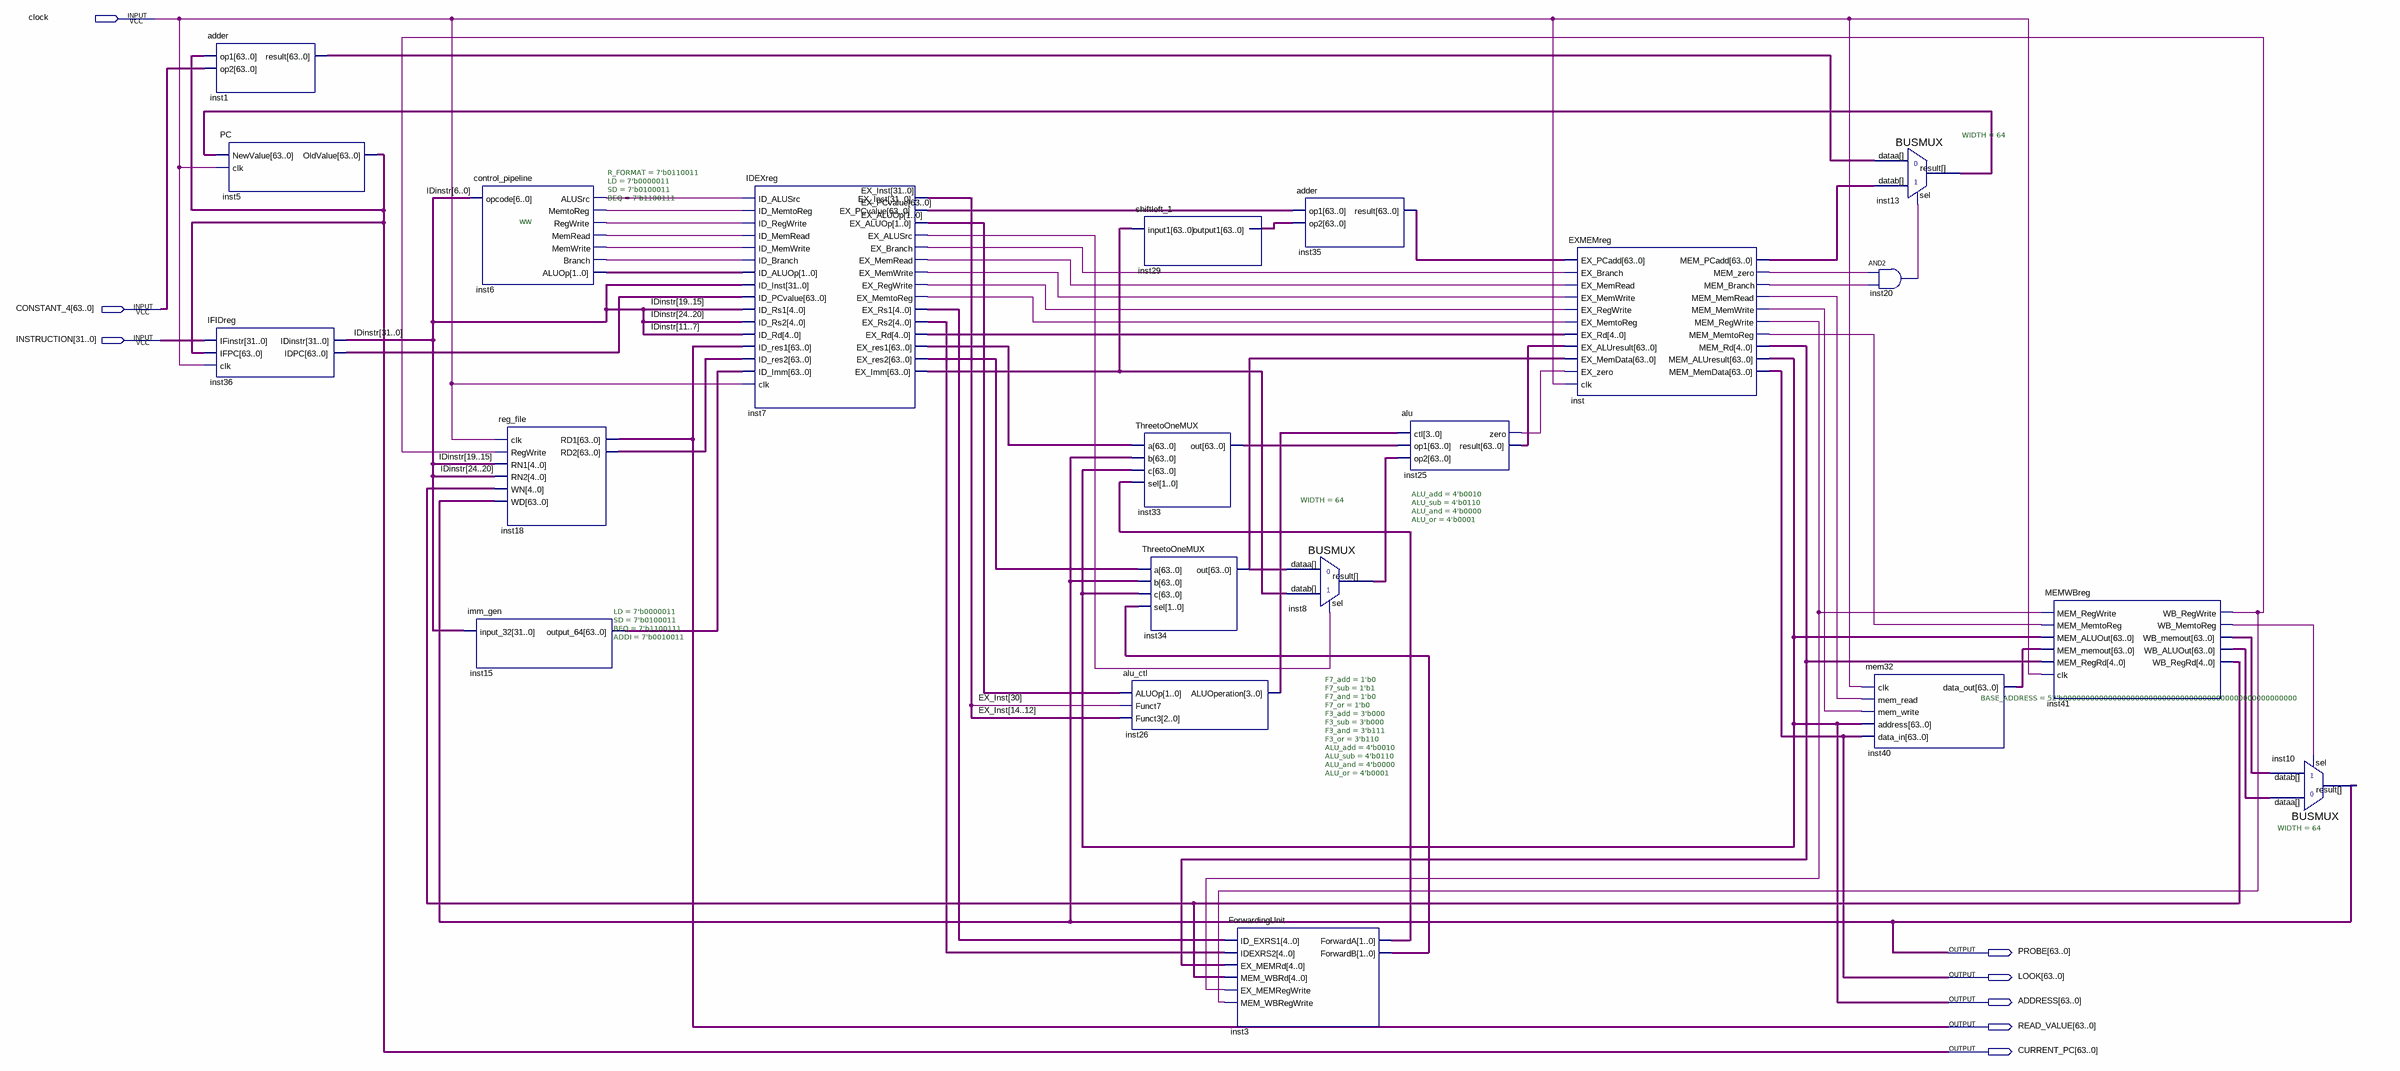
[diagram p0: schematic sheet]
// Quartus schematic project3_KSY.bdf as structural Verilog: 21 symbols, 8 pins
module project3_KSY (
  input  clock,
  input  [63:0] CONSTANT_4,
  input  [31:0] INSTRUCTION,
  output [63:0] PROBE,
  output [63:0] LOOK,
  output [63:0] ADDRESS,
  output [63:0] READ_VALUE,
  output [63:0] CURRENT_PC
);

  wire inst6_alusrc, inst6_branch, inst6_memread, inst6_memtoreg, inst6_memwrite, inst6_regwrite,
       inst7_ex_alusrc, inst7_ex_branch, inst7_ex_memread, inst7_ex_memtoreg, inst7_ex_memwrite,
       inst7_ex_regwrite, inst20_out, inst25_zero, inst41_wb_memtoreg, inst41_wb_regwrite, inst_mem_branch,
       inst_mem_memread, inst_mem_memtoreg, inst_mem_memwrite, inst_mem_regwrite, inst_mem_zero;
  wire [1:0] EX_ALUOp, inst3_forwarda, inst3_forwardb, inst6_aluop;
  wire [3:0] inst26_aluoperation;
  wire [4:0] inst7_ex_rd, inst7_ex_rs1, inst7_ex_rs2, inst41_wb_regrd, inst_mem_rd;
  wire [31:0] EX_Inst, IDinstr;
  wire [63:0] EX_PCvalue, inst1_result, inst7_ex_imm, inst7_ex_res1, inst7_ex_res2, inst8_result,
       inst13_result, inst15_output_64, inst18_rd2, inst25_result, inst29_output1, inst33_out, inst34_out,
       inst35_result, inst36_idpc, inst40_data_out, inst41_wb_aluout, inst41_wb_memout, inst_mem_pcadd;

  adder inst1 (.op1(CURRENT_PC), .op2(CONSTANT_4), .result(inst1_result));
  PC inst5 (.NewValue(inst13_result), .clk(clock), .OldValue(CURRENT_PC));
  IFIDreg inst36 (.IFinstr(INSTRUCTION), .IFPC(CURRENT_PC), .clk(clock), .IDinstr(IDinstr), .IDPC(inst36_idpc));
  control_pipeline #(.R_FORMAT(7'b0110011), .LD(7'b0000011), .SD(7'b0100011), .BEQ(7'b1100111)) inst6 (
    .opcode(IDinstr[6:0]), .ALUSrc(inst6_alusrc), .MemtoReg(inst6_memtoreg), .RegWrite(inst6_regwrite),
    .MemRead(inst6_memread), .MemWrite(inst6_memwrite), .Branch(inst6_branch), .ALUOp(inst6_aluop));
  imm_gen #(.LD(7'b0000011), .SD(7'b0100011), .BEQ(7'b1100111), .ADDI(7'b0010011)) inst15 (
    .input_32(IDinstr), .output_64(inst15_output_64));
  reg_file inst18 (
    .clk(clock), .RegWrite(inst41_wb_regwrite), .RN1(IDinstr[19:15]), .RN2(IDinstr[24:20]),
    .WN(inst41_wb_regrd), .WD(PROBE), .RD1(READ_VALUE), .RD2(inst18_rd2));
  IDEXreg inst7 (
    .ID_ALUSrc(inst6_alusrc), .ID_MemtoReg(inst6_memtoreg), .ID_RegWrite(inst6_regwrite),
    .ID_MemRead(inst6_memread), .ID_MemWrite(inst6_memwrite), .ID_Branch(inst6_branch),
    .ID_ALUOp(inst6_aluop), .ID_Inst(IDinstr), .ID_PCvalue(inst36_idpc), .ID_Rs1(IDinstr[19:15]),
    .ID_Rs2(IDinstr[24:20]), .ID_Rd(IDinstr[11:7]), .ID_res1(READ_VALUE), .ID_res2(inst18_rd2),
    .ID_Imm(inst15_output_64), .clk(clock), .EX_Inst(EX_Inst), .EX_PCvalue(EX_PCvalue), .EX_ALUOp(EX_ALUOp),
    .EX_ALUSrc(inst7_ex_alusrc), .EX_Branch(inst7_ex_branch), .EX_MemRead(inst7_ex_memread),
    .EX_MemWrite(inst7_ex_memwrite), .EX_RegWrite(inst7_ex_regwrite), .EX_MemtoReg(inst7_ex_memtoreg),
    .EX_Rs1(inst7_ex_rs1), .EX_Rs2(inst7_ex_rs2), .EX_Rd(inst7_ex_rd), .EX_res1(inst7_ex_res1),
    .EX_res2(inst7_ex_res2), .EX_Imm(inst7_ex_imm));
  shiftleft_1 inst29 (.input1(inst7_ex_imm), .output1(inst29_output1));
  ThreetoOneMUX inst33 (.a(inst7_ex_res1), .b(PROBE), .c(ADDRESS), .sel(inst3_forwarda), .out(inst33_out));
  alu_ctl #(.F7_add(1'b0), .F7_sub(1'b1), .F7_and(1'b0), .F7_or(1'b0), .F3_add(3'b000), .F3_sub(3'b000), .F3_and(3'b111), .F3_or(3'b110), .ALU_add(4'b0010), .ALU_sub(4'b0110), .ALU_and(4'b0000), .ALU_or(4'b0001)) inst26 (
    .ALUOp(EX_ALUOp), .Funct7(EX_Inst[30]), .Funct3(EX_Inst[14:12]), .ALUOperation(inst26_aluoperation));
  ThreetoOneMUX inst34 (.a(inst7_ex_res2), .b(PROBE), .c(ADDRESS), .sel(inst3_forwardb), .out(inst34_out));
  ForwardingUnit inst3 (
    .ID_EXRS1(inst7_ex_rs1), .IDEXRS2(inst7_ex_rs2), .EX_MEMRd(inst_mem_rd), .MEM_WBRd(inst41_wb_regrd),
    .EX_MEMRegWrite(inst_mem_regwrite), .MEM_WBRegWrite(inst41_wb_regwrite), .ForwardA(inst3_forwarda),
    .ForwardB(inst3_forwardb));
  adder inst35 (.op1(EX_PCvalue), .op2(inst29_output1), .result(inst35_result));
  BUSMUX #(.WIDTH(64)) inst8 (.datab(inst7_ex_imm), .sel(inst7_ex_alusrc), .dataa(inst34_out), .result(inst8_result));
  alu #(.ALU_add(4'b0010), .ALU_sub(4'b0110), .ALU_and(4'b0000), .ALU_or(4'b0001)) inst25 (
    .ctl(inst26_aluoperation), .op1(inst33_out), .op2(inst8_result), .zero(inst25_zero),
    .result(inst25_result));
  EXMEMreg inst (
    .EX_PCadd(inst35_result), .EX_Branch(inst7_ex_branch), .EX_MemRead(inst7_ex_memread),
    .EX_MemWrite(inst7_ex_memwrite), .EX_RegWrite(inst7_ex_regwrite), .EX_MemtoReg(inst7_ex_memtoreg),
    .EX_Rd(inst7_ex_rd), .EX_ALUresult(inst25_result), .EX_MemData(inst34_out), .EX_zero(inst25_zero),
    .clk(clock), .MEM_PCadd(inst_mem_pcadd), .MEM_zero(inst_mem_zero), .MEM_Branch(inst_mem_branch),
    .MEM_MemRead(inst_mem_memread), .MEM_MemWrite(inst_mem_memwrite), .MEM_RegWrite(inst_mem_regwrite),
    .MEM_MemtoReg(inst_mem_memtoreg), .MEM_Rd(inst_mem_rd), .MEM_ALUresult(ADDRESS), .MEM_MemData(LOOK));
  BUSMUX #(.WIDTH(64)) inst13 (.datab(inst_mem_pcadd), .sel(inst20_out), .dataa(inst1_result), .result(inst13_result));
  and inst20 (inst20_out, inst_mem_zero, inst_mem_branch);
  mem32 #(.BASE_ADDRESS(52'b0000000000000000000000000000000000000000000000000000)) inst40 (
    .clk(clock), .mem_read(inst_mem_memread), .mem_write(inst_mem_memwrite), .address(ADDRESS),
    .data_in(LOOK), .data_out(inst40_data_out));
  MEMWBreg inst41 (
    .MEM_RegWrite(inst_mem_regwrite), .MEM_MemtoReg(inst_mem_memtoreg), .MEM_ALUOut(ADDRESS),
    .MEM_memout(inst40_data_out), .MEM_RegRd(inst_mem_rd), .clk(clock), .WB_RegWrite(inst41_wb_regwrite),
    .WB_MemtoReg(inst41_wb_memtoreg), .WB_memout(inst41_wb_memout), .WB_ALUOut(inst41_wb_aluout),
    .WB_RegRd(inst41_wb_regrd));
  BUSMUX #(.WIDTH(64)) inst10 (
    .datab(inst41_wb_memout), .sel(inst41_wb_memtoreg), .dataa(inst41_wb_aluout), .result(PROBE));

  // Notes on the sheet:
  //   ww
endmodule
